# EAGLE schematic HydroPCBedits (EAGLE 9.3.2)
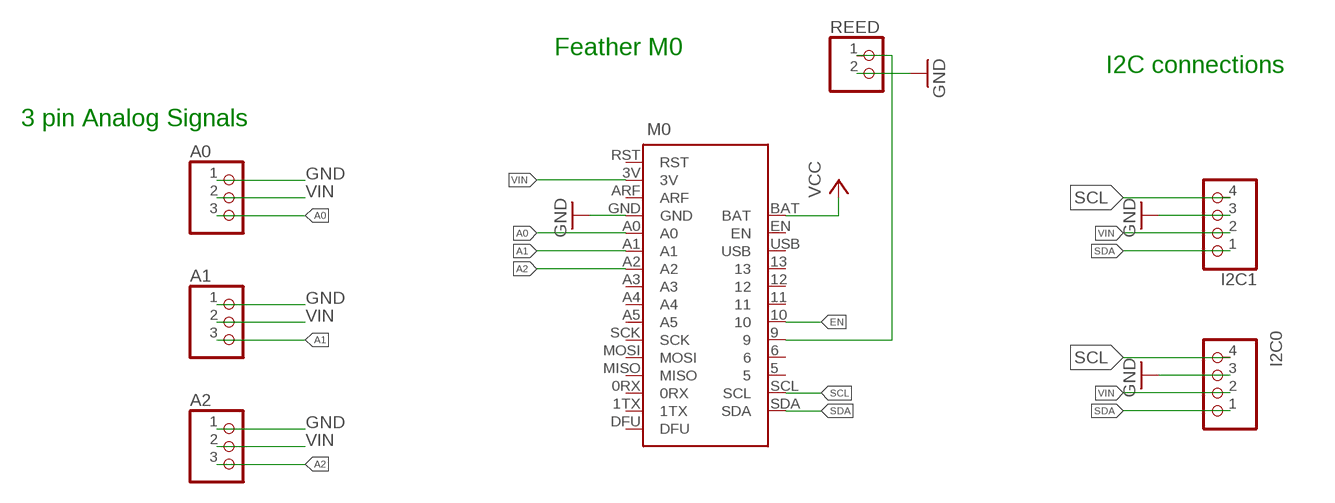
[diagram p0: schematic, sheet 1]

## Parts
A0  PINHD-1X3  [1X03]
A1  PINHD-1X3  [1X03]
A2  PINHD-1X3  [1X03]
I2C0  PINHD-1X4  [1X04]
I2C1  PINHD-1X4  [1X04]
M0  BLUEFRUIT_M0  [BLUEFRUIT_MO]
REED  PINHD-1X2  [1X02]

## Nets
A0: A0.3 M0.A0
A1: A1.3 M0.A1
A2: A2.3 M0.A2
EN: M0.10
GND: A0.1 A1.1 A2.1 I2C0.3 I2C1.3 M0.GND REED.2
N$2: M0.9 REED.1
SCL: I2C0.4 I2C1.4 M0.SCL
SDA: I2C0.1 I2C1.1 M0.SDA
VCC: M0.BAT
VIN: A0.2 A1.2 A2.2 I2C0.2 I2C1.2 M0.3V
Unconnected: M0.0RX M0.1TX M0.5 M0.6 M0.11 M0.12 M0.13 M0.A3 M0.A4 M0.A5 M0.ARF M0.DFU M0.EN M0.MISO M0.MOSI M0.RST M0.SCK M0.USB

## Notes on the sheet
- Feather M0
- I2C connections
- 3 pin Analog Signals

## Library data of the parts
A0 A1 A2 = pinhead:PINHD-1X3: PIN HEADER
I2C0 I2C1 = pinhead:PINHD-1X4: PIN HEADER
M0 = bluefruit_m0:BLUEFRUIT_M0
REED = pinhead:PINHD-1X2: PIN HEADER

## Module TURB
Ports: 

### Library data of the parts

## Net classes
0 default: width 0.254 mm, clearance 0.203 mm
1 power: width 0.356 mm, clearance 0.254 mm